# EAGLE design fps_revc (EAGLE 9.6.2)
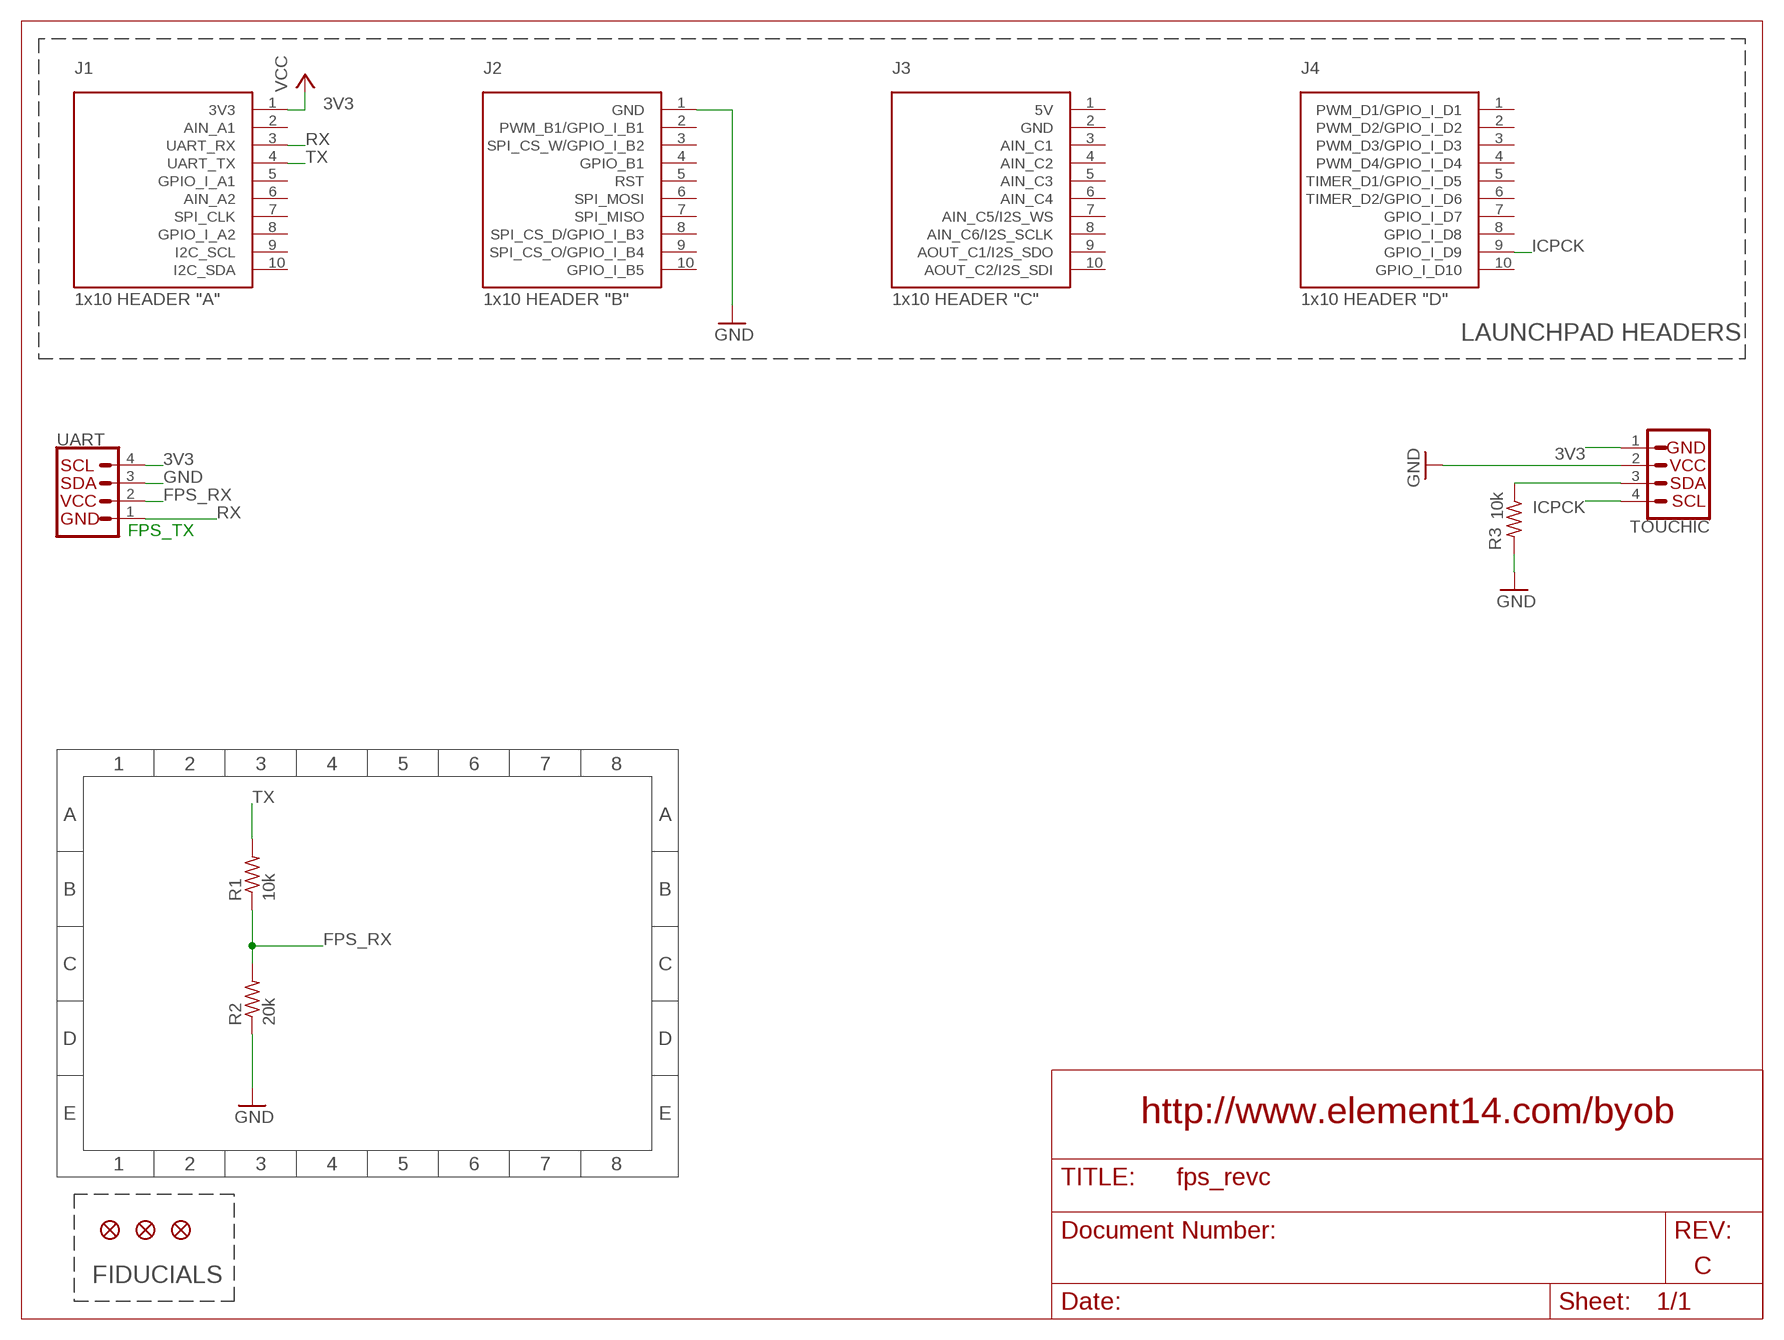
[diagram p0: schematic, sheet 1]

## Parts
FID1  FIDUCIAL  [FIDUCIAL_L10]
FID2  FIDUCIAL  [FIDUCIAL_L10]
FID3  FIDUCIAL  [FIDUCIAL_L10]
J1  1x10 HEADER "A"  HEADER-1X10-J1  [1X10]
J2  1x10 HEADER "B"  HEADER-1X10-J2  [1X10]
J3  1x10 HEADER "C"  HEADER-1X10-J3  [1X10]
J4  1x10 HEADER "D"  HEADER-1X10-J4  [1X10]
R1  10k  R-US_R0805  [R0805]
R2  20k  R-US_R0805  [R0805]
R3  10k  R-US_R0805  [R0805]
TOUCHIC  QWIIC_CONNECTORJS-1MM  [1X04_1MM_RA]
UART  QWIIC_CONNECTORJS-1MM  [1X04_1MM_RA]

## Nets
3V3: J1.1(3V3) TOUCHIC.1(GND) UART.4(SCL) ; supply symbol labelled VCC
FPS_RX: R1.1 R2.2 UART.2(VCC)
GND: J2.1(GND) R2.1 R3.2 TOUCHIC.2(VCC) UART.3(SDA)
ICPCK: J4.9(GPIO_I_D9) TOUCHIC.4(SCL)
N$1: R3.1 TOUCHIC.3(SDA)
RX: J1.3(UART_RX) UART.1(GND)
TX: J1.4(UART_TX) R1.2
Unconnected: J1.2(AIN_A1) J1.5(GPIO_I_A1) J1.6(AIN_A2) J1.7(SPI_CLK) J1.8(GPIO_I_A2) J1.9(I2C_SCL) J1.10(I2C_SDA) J2.2(PWM_B1/GPIO_I_B1) J2.3(SPI_CS_W/GPIO_I_B2) J2.4(GPIO_B1) J2.5(RST) J2.6(SPI_MOSI) J2.7(SPI_MISO) J2.8(SPI_CS_D/GPIO_I_B3) J2.9(SPI_CS_O/GPIO_I_B4) J2.10(GPIO_I_B5) J3.1(5V) J3.2(GND) J3.3(AIN_C1) J3.4(AIN_C2) J3.5(AIN_C3) J3.6(AIN_C4) J3.7(AIN_C5/I2S_WS) J3.8(AIN_C6/I2S_SCLK) J3.9(AOUT_C1/I2S_SDO) J3.10(AOUT_C2/I2S_SDI) J4.1(PWM_D1/GPIO_I_D1) J4.2(PWM_D2/GPIO_I_D2) J4.3(PWM_D3/GPIO_I_D3) J4.4(PWM_D4/GPIO_I_D4) J4.5(TIMER_D1/GPIO_I_D5) J4.6(TIMER_D2/GPIO_I_D6) J4.7(GPIO_I_D7) J4.8(GPIO_I_D8) J4.10(GPIO_I_D10)

## Notes on the sheet
- LAUNCHPAD HEADERS
- FPS_TX
- http://www.element14.com/byob
- C
- FIDUCIALS

## Library data of the parts
FID1-FID3 = CCo-Boost:FIDUCIAL: Fiducial Alignment Points Various fiducial points for machine vision alignment.; OC_NEWARK: unknown
J1 = CCo-Boost:HEADER-1X10-J1: 1x10 BoosterPack Header J1 This 1x10 header matches the pinout of J1 header of the BoosterPack Pinout Standard.; MF: SAMTEC; MPN: SSW-110-23-F-D; OC_NEWARK: 82P5550
J2 = CCo-Boost:HEADER-1X10-J2: 1x10 BoosterPack Header J2 This 1x10 header matches the pinout of J2 header of the BoosterPack Pinout Standard.; MF: SAMTEC; MPN: SSW-110-23-F-D; OC_NEWARK: 82P5550
J3 = CCo-Boost:HEADER-1X10-J3: 1x10 BoosterPack Header J3 This 1x10 header matches the pinout of J3 header of the BoosterPack Pinout Standard.; OC_NEWARK: unknown
J4 = CCo-Boost:HEADER-1X10-J4: 1x10 BoosterPack Header J4 This 1x10 header matches the pinout of J4 header of the BoosterPack Pinout Standard.; OC_NEWARK: unknown
R1 R3 = adafruit:R-US_: RESISTOR, American symbol; MF: PANASONIC; MPN: ERJ6GEYJ103V; OC_NEWARK: 53W8524
R2 = adafruit:R-US_: RESISTOR, American symbol; MF: VISHAY; MPN: CRCW080520K0FKEB; OC_NEWARK: 65J1661
TOUCHIC UART = SparkFun-Connectors:QWIIC_CONNECTOR: SparkFun I2C Standard Qwiic Connector An SMD 1mm pitch JST connector makes it easy and quick (get it? Qwiic?) to connect I2C devices to each other. The Qwiic system <http://www.sparkfun.com/qwiic> enables fast and solderless connection between popular platforms and various sensors and actuators. We carry 200mm <https://www.sparkfun.com/products/14204>, 100mm <https://www.sparkfun.com/products/14205>, 50mm <https://www.sparkfun.com/products/14206>, and breadboard friendly <https://www.sparkfun.com/products/14207> Qwiic cables. We also offer 10 pcs strips <https://www.sparkfun.com/products/14323> the SMD connectors.; MF: JST (JAPAN SOLDERLESS TERMINALS); MPN: SM04B-SRSS-TB(LF)(SN); OC_NEWARK: 87R0314

## Board
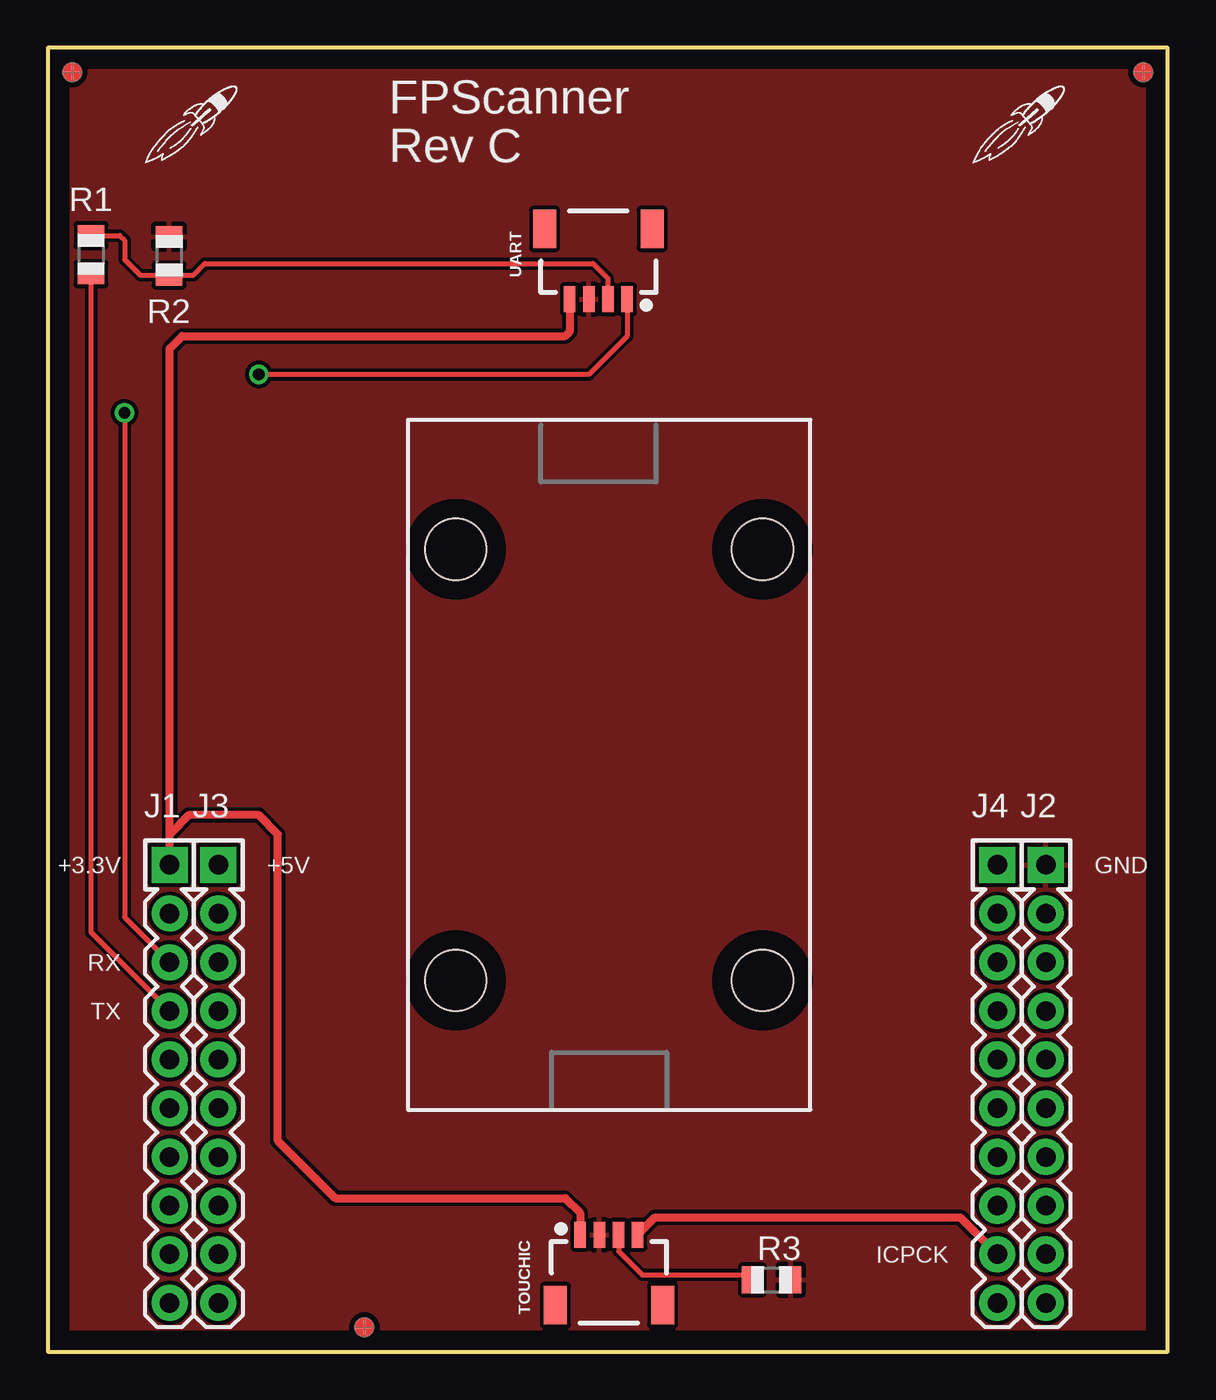
[diagram p1: board, top side]
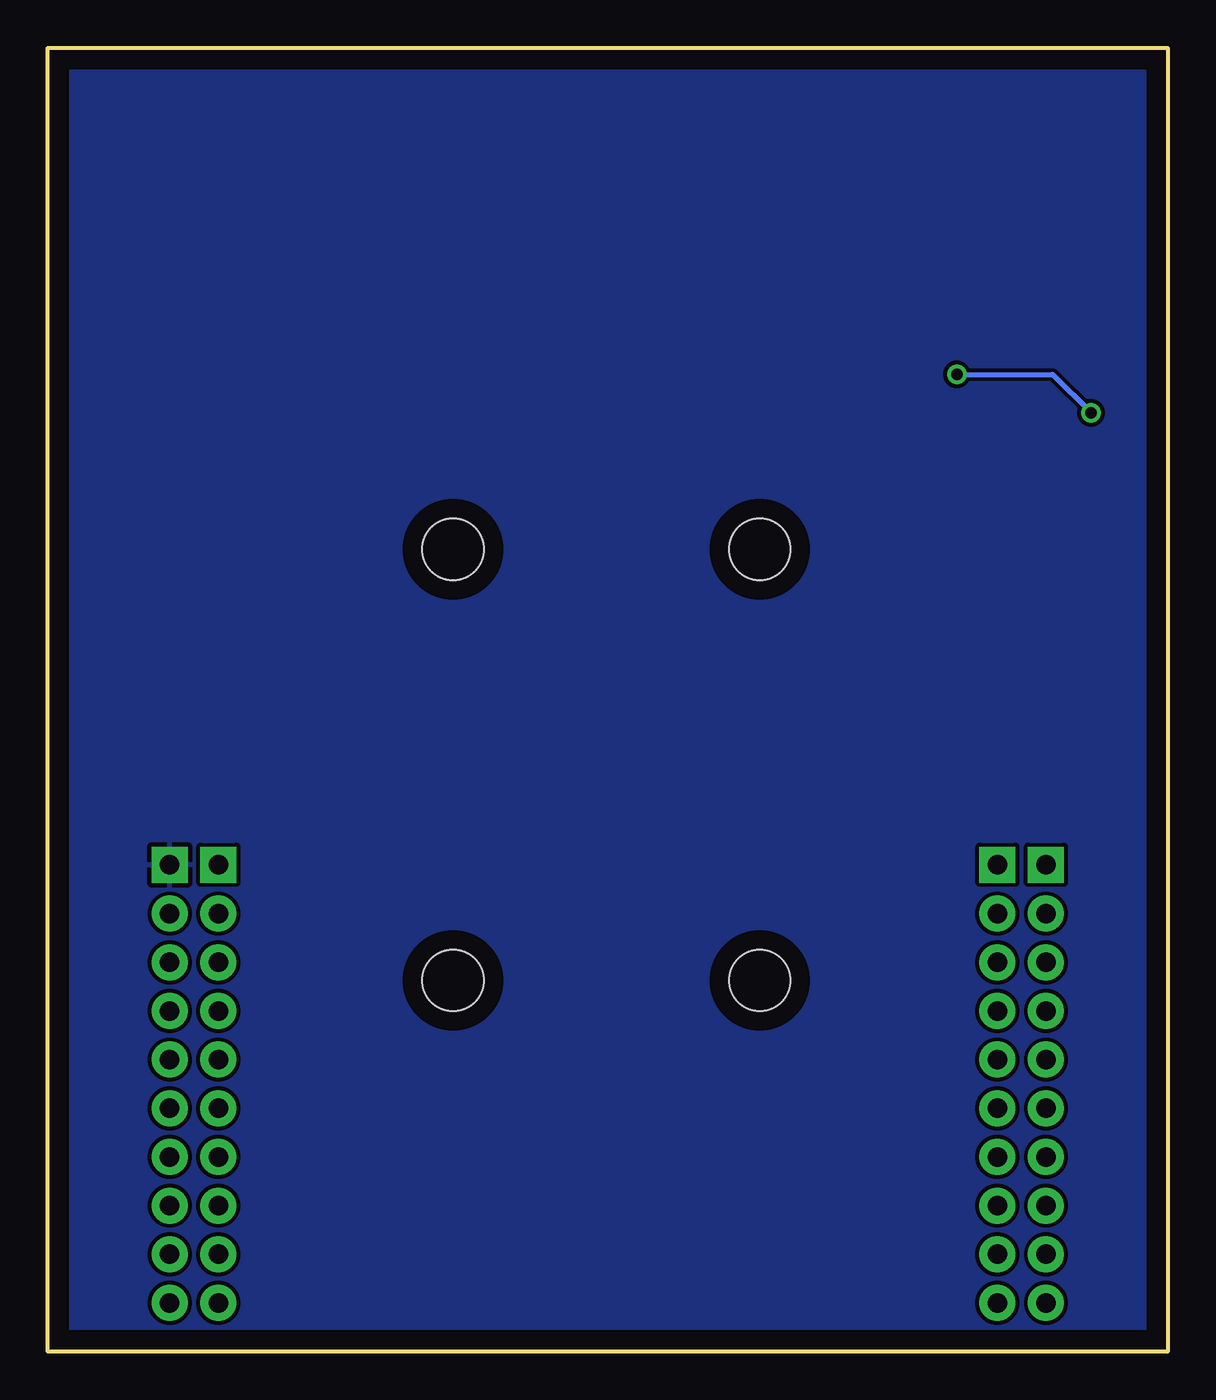
[diagram p2: board, bottom side, seen from below]

Size 58.42 x 68.04 mm. Coordinates in mm from the lower left corner, seen from the top.
Outline: 0,0 58.42,0 58.42,68.04 0,68.04 0,0
Copper layers (1*16): Top 0.035mm / dielectric 1.5mm / Bottom 0.035mm
Design rules "default": minimum track width 10mil, minimum drill 24mil, track to track 8mil, track to pad 8mil, pad to pad 8mil, via to via 8mil, smd to smd 8mil, copper to edge 40mil, drill to drill 8mil, minimum pad ring 10mil, minimum via ring 8mil, stop-mask expansion 4mil, vias tented up to drill 0mil, thermal gap 10mil
Holes 3.2 mm at 37.28,19.37 37.28,41.87 21.28,19.37 21.28,41.87

### Footprints (pad centres in the part's own frame; a part is rotated, then mirrored left to right if it is on the bottom)
1X10 = drill 1.016 pad 1.88 square: 1 0,10.16 | drill 1.016 pad 1.88: 2 0,7.62; 3 0,5.08; 4 0,2.54; 5 0,0; 6 0,-2.54; 7 0,-5.08; 8 0,-7.62; 9 0,-10.16; 10 0,-12.7
R0805 = smd 1.1 x 1.4: 1 -1,0; 2 1,0
1X04_1MM_RA = smd 0.6 x 1.35: 1 -1.5,0; 2 -0.5,0; 3 0.5,0; 4 1.5,0 | smd 1.2 x 2: NC1 2.8,-3.675; NC2 -2.8,-3.675

### Placement (x,y rotation side)
FID1  1.27,66.77 0 top
FID2  57.15,66.77 0 top
FID3  16.51,1.27 0 top
J1  6.35,15.24 0 top
J2  52.07,15.24 0 top
J3  8.89,15.24 0 top
J4  49.53,15.24 0 top
R1  2.25,57.25 270 top
R2  6.32,57.19 270 top
R3  37.75,3.75 0 top
TOUCHIC  29.27,6.1 0 top
U$1  [LOGO-ROCKET]  50.8,64.23 0 top
U$2  [LOGO-ROCKET]  7.62,64.23 0 top
UART  28.72,54.92 180 top

### Tracks (layer width: path | path; a pad name or v marks a point on that pad's centre or on a via)
3V3
  Top 0.406: UART.4 27.22,53.22 27,53 7,53 6.35,52.35 6.35,27 | J1.1 6.35,27 | 6.35,27 7.35,28 11,28 12,27 12,11 14,9 15,8 27,8 27.77,7.23 TOUCHIC.1
FPS_RX
  Top 0.254: R1.1 3.75,58.25 4,58 4,57 4.81,56.19 R2.2 7.6,56.19 8.19,56.78 28.45,56.78 29.11,56.12 29.22,56.01 UART.2
GND
  pour Top: -2.5,70 60,70 61.25,68.75 61.25,-3.75 -2.5,-3.75
  pour Bottom: -2.5,70 -2.5,-3.75 61.25,-3.75 61.25,68.75 60,70
ICPCK
  Top 0.406: TOUCHIC.4 31.67,7 47.61,7 J4.9
N$1
  Top 0.254: TOUCHIC.3 29.77,5.23 31,4 36.5,4 R3.1
RX  (via drill 0.61)
  Top 0.254: UART.1 30.22,53.01 28.21,51 v11,51 | v4,49 4,22.67 J1.3
  Bottom 0.254: v11,51 6,51 v4,49
TX
  Top 0.254: J1.4 2.25,21.88 R1.2

### Text on the board
tPlace: FPScanner | Rev C | +3.3V | +5V | GND | RX | TX | ICPCK